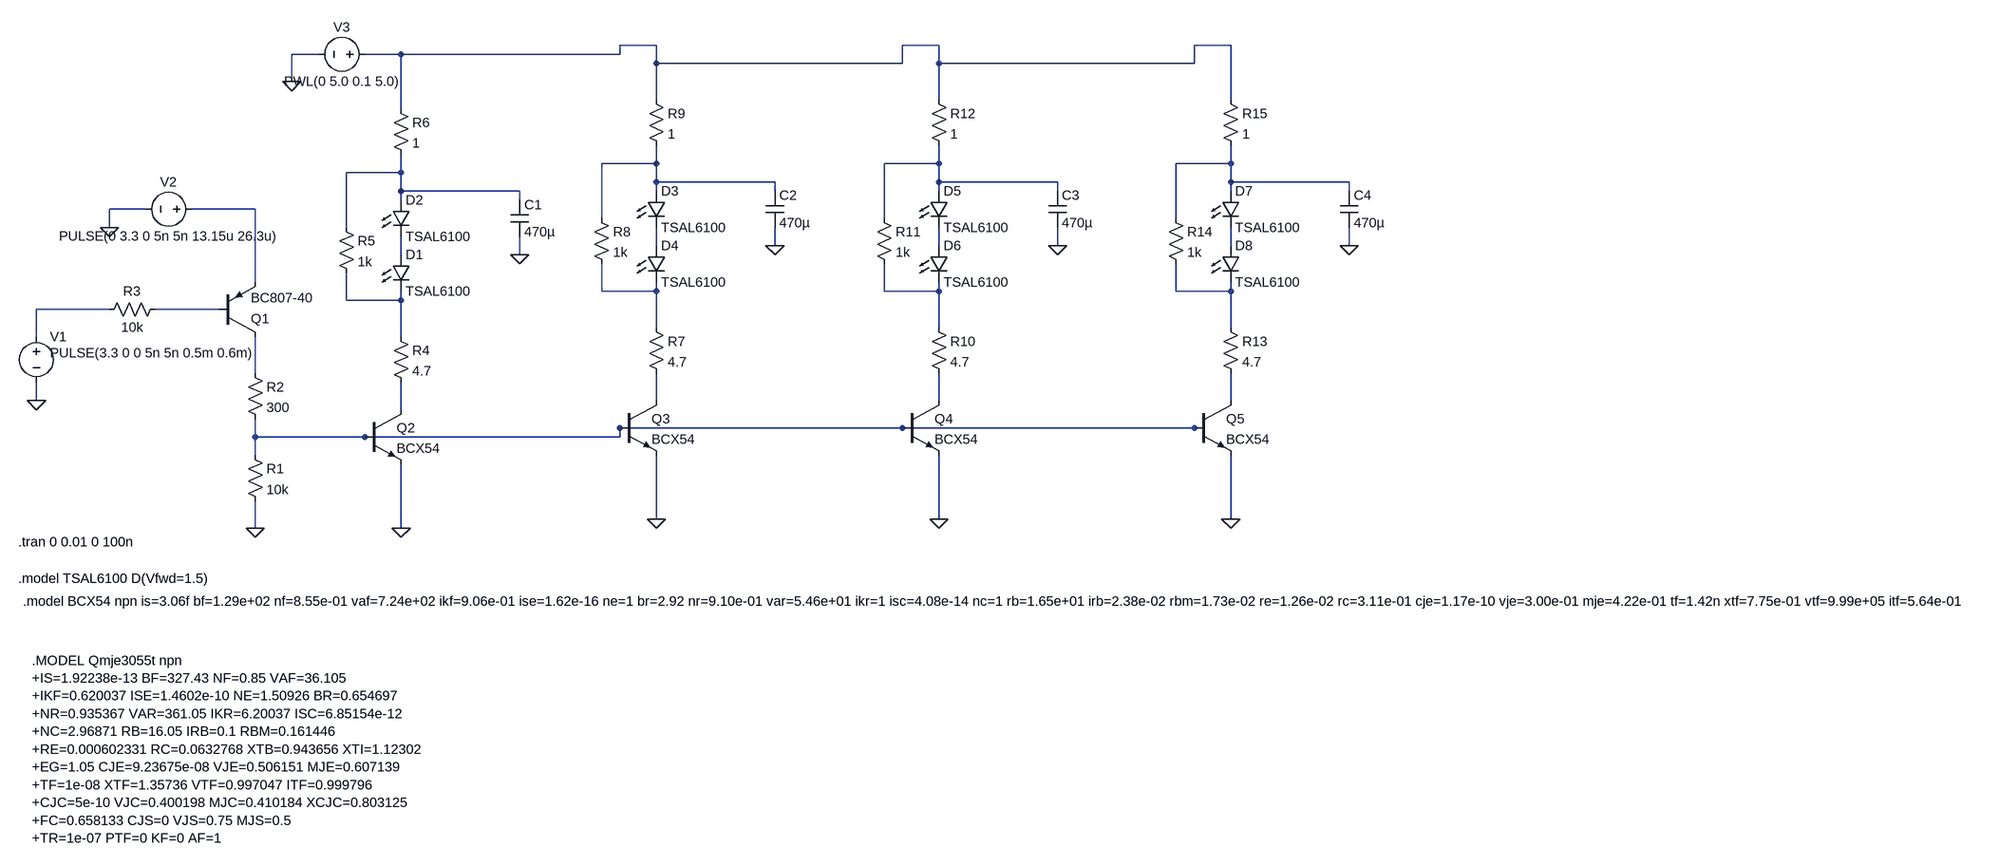
[diagram p0: schematic Emitter.asc]
Emitter.asc, the LTspice schematic file:
Version 4
SHEET 1 4760 784
WIRE 752 -592 688 -592
WIRE 1248 -592 1184 -592
WIRE 1760 -592 1696 -592
WIRE 160 -576 112 -576
WIRE 304 -576 240 -576
WIRE 688 -576 688 -592
WIRE 688 -576 304 -576
WIRE 752 -560 752 -592
WIRE 1184 -560 1184 -592
WIRE 1184 -560 752 -560
WIRE 1248 -560 1248 -592
WIRE 1696 -560 1696 -592
WIRE 1696 -560 1248 -560
WIRE 112 -528 112 -576
WIRE 752 -496 752 -560
WIRE 1248 -496 1248 -560
WIRE 1760 -496 1760 -592
WIRE 304 -480 304 -576
WIRE 752 -384 752 -416
WIRE 752 -384 656 -384
WIRE 1248 -384 1248 -416
WIRE 1248 -384 1152 -384
WIRE 1760 -384 1760 -416
WIRE 1760 -384 1664 -384
WIRE 304 -368 304 -400
WIRE 304 -368 208 -368
WIRE 752 -352 752 -384
WIRE 960 -352 752 -352
WIRE 1248 -352 1248 -384
WIRE 1456 -352 1248 -352
WIRE 1760 -352 1760 -384
WIRE 1968 -352 1760 -352
WIRE 304 -336 304 -368
WIRE 512 -336 304 -336
WIRE 752 -336 752 -352
WIRE 960 -336 960 -352
WIRE 1248 -336 1248 -352
WIRE 1456 -336 1456 -352
WIRE 1760 -336 1760 -352
WIRE 1968 -336 1968 -352
WIRE 304 -320 304 -336
WIRE 512 -320 512 -336
WIRE -144 -304 -208 -304
WIRE 48 -304 -64 -304
WIRE 656 -288 656 -384
WIRE 1152 -288 1152 -384
WIRE 1664 -288 1664 -384
WIRE -208 -272 -208 -304
WIRE 208 -272 208 -368
WIRE 752 -240 752 -272
WIRE 960 -240 960 -272
WIRE 1248 -240 1248 -272
WIRE 1456 -240 1456 -272
WIRE 1760 -240 1760 -272
WIRE 1968 -240 1968 -272
WIRE 304 -224 304 -256
WIRE 512 -224 512 -256
WIRE 48 -176 48 -304
WIRE 656 -160 656 -208
WIRE 752 -160 752 -176
WIRE 752 -160 656 -160
WIRE 1152 -160 1152 -208
WIRE 1248 -160 1248 -176
WIRE 1248 -160 1152 -160
WIRE 1664 -160 1664 -208
WIRE 1760 -160 1760 -176
WIRE 1760 -160 1664 -160
WIRE 208 -144 208 -192
WIRE 304 -144 304 -160
WIRE 304 -144 208 -144
WIRE -208 -128 -336 -128
WIRE -16 -128 -128 -128
WIRE 752 -96 752 -160
WIRE 1248 -96 1248 -160
WIRE 1760 -96 1760 -160
WIRE -336 -80 -336 -128
WIRE 304 -80 304 -144
WIRE 48 -16 48 -80
WIRE -336 32 -336 0
WIRE 752 32 752 -16
WIRE 1248 32 1248 -16
WIRE 1760 32 1760 -16
WIRE 304 48 304 0
WIRE 1184 80 688 80
WIRE 1696 80 1184 80
WIRE 1712 80 1696 80
WIRE 48 96 48 64
WIRE 240 96 48 96
WIRE 688 96 688 80
WIRE 688 96 240 96
WIRE 48 128 48 96
WIRE 752 240 752 128
WIRE 1248 240 1248 128
WIRE 1760 240 1760 128
WIRE 48 256 48 208
WIRE 304 256 304 144
FLAG 48 256 0
FLAG 304 256 0
FLAG -336 32 0
FLAG -208 -272 0
FLAG 112 -528 0
FLAG 512 -224 0
FLAG 752 240 0
FLAG 960 -240 0
FLAG 1248 240 0
FLAG 1456 -240 0
FLAG 1760 240 0
FLAG 1968 -240 0
SYMBOL res 32 112 R0
SYMATTR InstName R1
SYMATTR Value 10k
SYMBOL res 32 -32 R0
SYMATTR InstName R2
SYMATTR Value 300
SYMBOL pnp -16 -80 M180
SYMATTR InstName Q1
SYMATTR Value BC807-40
SYMBOL npn 240 48 R0
SYMATTR InstName Q2
SYMATTR Value BCX54
SYMBOL res -112 -144 R90
WINDOW 0 0 56 VBottom 2
WINDOW 3 32 56 VTop 2
SYMATTR InstName R3
SYMATTR Value 10k
SYMBOL res 288 -96 R0
SYMATTR InstName R4
SYMATTR Value 4.7
SYMBOL res 192 -288 R0
SYMATTR InstName R5
SYMATTR Value 1k
SYMBOL LED 288 -320 R0
SYMATTR InstName D2
SYMATTR Value TSAL6100
SYMBOL voltage -336 -96 R0
WINDOW 3 24 44 Left 2
WINDOW 123 0 0 Left 0
WINDOW 39 0 0 Left 0
SYMATTR Value PULSE(3.3 0 0 5n 5n 0.5m 0.6m)
SYMATTR InstName V1
SYMBOL voltage -48 -304 R90
WINDOW 0 -32 56 VBottom 2
WINDOW 3 32 56 VTop 2
WINDOW 123 0 0 Left 0
WINDOW 39 0 0 Left 0
SYMATTR InstName V2
SYMATTR Value PULSE(0 3.3 0 5n 5n 13.15u 26.3u)
SYMBOL voltage 256 -576 R90
WINDOW 0 -32 56 VBottom 2
WINDOW 3 32 56 VTop 2
WINDOW 123 0 0 Left 0
WINDOW 39 0 0 Left 0
SYMATTR InstName V3
SYMATTR Value PWL(0 5.0 0.1 5.0)
SYMBOL res 288 -496 R0
SYMATTR InstName R6
SYMATTR Value 1
SYMBOL cap 496 -320 R0
SYMATTR InstName C1
SYMATTR Value 470µ
SYMBOL LED 288 -224 R0
SYMATTR InstName D1
SYMATTR Value TSAL6100
SYMBOL npn 688 32 R0
SYMATTR InstName Q3
SYMATTR Value BCX54
SYMBOL res 736 -112 R0
SYMATTR InstName R7
SYMATTR Value 4.7
SYMBOL res 640 -304 R0
SYMATTR InstName R8
SYMATTR Value 1k
SYMBOL LED 736 -336 R0
SYMATTR InstName D3
SYMATTR Value TSAL6100
SYMBOL res 736 -512 R0
SYMATTR InstName R9
SYMATTR Value 1
SYMBOL cap 944 -336 R0
SYMATTR InstName C2
SYMATTR Value 470µ
SYMBOL LED 736 -240 R0
SYMATTR InstName D4
SYMATTR Value TSAL6100
SYMBOL npn 1184 32 R0
SYMATTR InstName Q4
SYMATTR Value BCX54
SYMBOL res 1232 -112 R0
SYMATTR InstName R10
SYMATTR Value 4.7
SYMBOL res 1136 -304 R0
SYMATTR InstName R11
SYMATTR Value 1k
SYMBOL LED 1232 -336 R0
SYMATTR InstName D5
SYMATTR Value TSAL6100
SYMBOL res 1232 -512 R0
SYMATTR InstName R12
SYMATTR Value 1
SYMBOL cap 1440 -336 R0
SYMATTR InstName C3
SYMATTR Value 470µ
SYMBOL LED 1232 -240 R0
SYMATTR InstName D6
SYMATTR Value TSAL6100
SYMBOL npn 1696 32 R0
SYMATTR InstName Q5
SYMATTR Value BCX54
SYMBOL res 1744 -112 R0
SYMATTR InstName R13
SYMATTR Value 4.7
SYMBOL res 1648 -304 R0
SYMATTR InstName R14
SYMATTR Value 1k
SYMBOL LED 1744 -336 R0
SYMATTR InstName D7
SYMATTR Value TSAL6100
SYMBOL res 1744 -512 R0
SYMATTR InstName R15
SYMATTR Value 1
SYMBOL cap 1952 -336 R0
SYMATTR InstName C4
SYMATTR Value 470µ
SYMBOL LED 1744 -240 R0
SYMATTR InstName D8
SYMATTR Value TSAL6100
TEXT -368 280 Left 2 !.tran 0 0.01 0 100n
TEXT -368 344 Left 2 !.model TSAL6100 D(Vfwd=1.5)
TEXT -360 384 Left 2 !.model BCX54 npn is=3.06f bf=1.29e+02 nf=8.55e-01 vaf=7.24e+02 ikf=9.06e-01 ise=1.62e-16 ne=1 br=2.92 nr=9.10e-01 var=5.46e+01 ikr=1 isc=4.08e-14 nc=1 rb=1.65e+01 irb=2.38e-02 rbm=1.73e-02 re=1.26e-02 rc=3.11e-01 cje=1.17e-10 vje=3.00e-01 mje=4.22e-01 tf=1.42n xtf=7.75e-01 vtf=9.99e+05 itf=5.64e-01 cjc=4.85e-11 vjc=3.00e-01 mjc=5.09e-01 tr=1u xtb=0 eg=1.11 xti=3 fc=0.5 Vceo=45 Icrating=1 mfg=Philips
TEXT -344 488 Left 2 !.MODEL Qmje3055t npn\n+IS=1.92238e-13 BF=327.43 NF=0.85 VAF=36.105\n+IKF=0.620037 ISE=1.4602e-10 NE=1.50926 BR=0.654697\n+NR=0.935367 VAR=361.05 IKR=6.20037 ISC=6.85154e-12\n+NC=2.96871 RB=16.05 IRB=0.1 RBM=0.161446\n+RE=0.000602331 RC=0.0632768 XTB=0.943656 XTI=1.12302\n+EG=1.05 CJE=9.23675e-08 VJE=0.506151 MJE=0.607139\n+TF=1e-08 XTF=1.35736 VTF=0.997047 ITF=0.999796\n+CJC=5e-10 VJC=0.400198 MJC=0.410184 XCJC=0.803125\n+FC=0.658133 CJS=0 VJS=0.75 MJS=0.5\n+TR=1e-07 PTF=0 KF=0 AF=1

The netlist it stands for:
* Emitter.asc
R1 N022 0 10k
R2 N017 N022 300
Q1 N017 N016 N006 0 BC807-40
Q2 N021 N022 0 0 BCX54
R3 N016 N015 10k
R4 N014 N021 4.7
R5 N005 N014 1k
D2 N005 N010 TSAL6100
V1 N015 0 PULSE(3.3 0 0 5n 5n 0.5m 0.6m)
V2 N006 0 PULSE(0 3.3 0 5n 5n 13.15u 26.3u)
V3 N001 0 PWL(0 5.0 0.1 5.0)
R6 N001 N005 1
C1 N005 0 470µ
D1 N010 N014 TSAL6100
Q3 N018 N022 0 0 BCX54
R7 N011 N018 4.7
R8 N002 N011 1k
D3 N002 N007 TSAL6100
R9 N001 N002 1
C2 N002 0 470µ
D4 N007 N011 TSAL6100
Q4 N019 N022 0 0 BCX54
R10 N012 N019 4.7
R11 N003 N012 1k
D5 N003 N008 TSAL6100
R12 N001 N003 1
C3 N003 0 470µ
D6 N008 N012 TSAL6100
Q5 N020 N022 0 0 BCX54
R13 N013 N020 4.7
R14 N004 N013 1k
D7 N004 N009 TSAL6100
R15 N001 N004 1
C4 N004 0 470µ
D8 N009 N013 TSAL6100
.model D D
.lib standard.dio
.model NPN NPN
.model PNP PNP
.lib standard.bjt
.tran 0 0.01 0 100n
.model TSAL6100 D(Vfwd=1.5)
.model BCX54 npn is=3.06f bf=1.29e+02 nf=8.55e-01 vaf=7.24e+02 ikf=9.06e-01 ise=1.62e-16 ne=1 br=2.92 nr=9.10e-01 var=5.46e+01 ikr=1 isc=4.08e-14 nc=1 rb=1.65e+01 irb=2.38e-02 rbm=1.73e-02 re=1.26e-02 rc=3.11e-01 cje=1.17e-10 vje=3.00e-01 mje=4.22e-01 tf=1.42n xtf=7.75e-01 vtf=9.99e+05 itf=5.64e-01 cjc=4.85e-11 vjc=3.00e-01 mjc=5.09e-01 tr=1u xtb=0 eg=1.11 xti=3 fc=0.5 Vceo=45 Icrating=1 mfg=Philips
.MODEL Qmje3055t npn
+IS=1.92238e-13 BF=327.43 NF=0.85 VAF=36.105
+IKF=0.620037 ISE=1.4602e-10 NE=1.50926 BR=0.654697
+NR=0.935367 VAR=361.05 IKR=6.20037 ISC=6.85154e-12
+NC=2.96871 RB=16.05 IRB=0.1 RBM=0.161446
+RE=0.000602331 RC=0.0632768 XTB=0.943656 XTI=1.12302
+EG=1.05 CJE=9.23675e-08 VJE=0.506151 MJE=0.607139
+TF=1e-08 XTF=1.35736 VTF=0.997047 ITF=0.999796
+CJC=5e-10 VJC=0.400198 MJC=0.410184 XCJC=0.803125
+FC=0.658133 CJS=0 VJS=0.75 MJS=0.5
+TR=1e-07 PTF=0 KF=0 AF=1
.backanno
.end